# EAGLE schematic rfid (EAGLE 6.3)
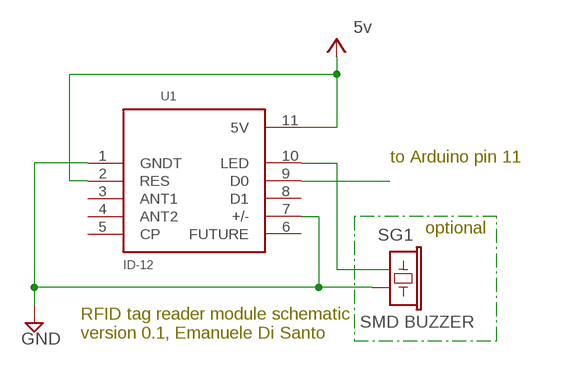
[diagram p0: schematic, sheet 1]

## Parts
SG1  SMD BUZZER  BUZZERSMD2  [BUZZER-CCV]
U1  ID-12  ID-12/20  [ID-12]

## Nets
GND: SG1.- U1.1(GNDT) U1.7(+/-)
N$1: U1.10(LED)
N$2: U1.9(D0)
VCC: U1.2(RES) U1.11(5V) ; supply symbol labelled 5v
Unconnected: SG1.+ U1.3(ANT1) U1.4(ANT2) U1.5(CP) U1.6(FUTURE) U1.8(D1)

## Notes on the sheet
- to Arduino pin 11
- optional
- RFID tag reader module schematic
  version 0.1, Emanuele Di Santo

## Library data of the parts
SG1 = SparkFun-Electromechanical:BUZZER: Buzzer 12mm Spark Fun Electronics SKU : Comp-Buzzer
U1 = SparkFun-RF:ID-12/20: RFID reader for ID2, ID12, and ID20 Package